# Altium schematic sheet modul RF.SchDoc
size A
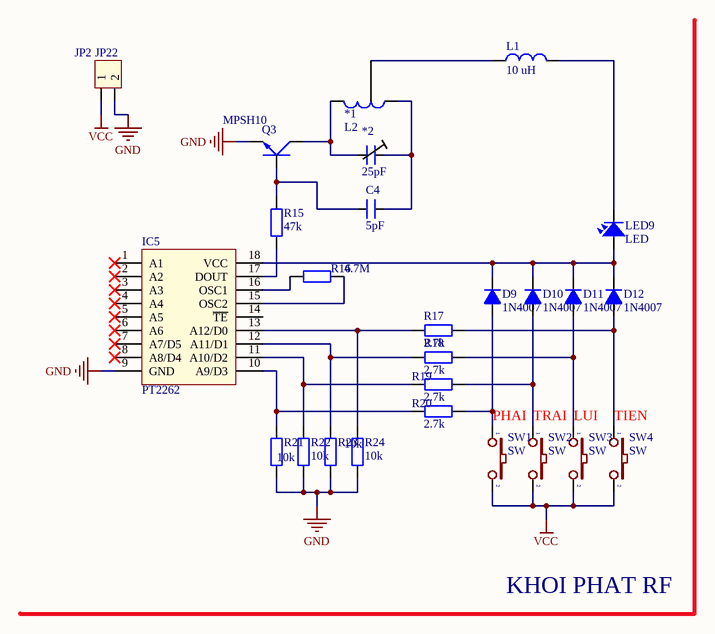
[diagram p0: modul RF.SchDoc]

## Parts
*1  L2
*2  25pF
C4  5pF  [CN1]
D9  1N4007  [D1A]
D10  1N4007  [D1A]
D11  1N4007  [D1A]
D12  1N4007  [D1A]
IC5  PT2262  [DIP18/W0.3]
JP22  JP2  [CON2]
L1  10 uH  [L/0.4]
LED9  LED  [LED-3]
Q3  MPSH10  [QTO-92]
R15  47k  [R1/4W]
R16  4.7M  [R1/4W]
R17  2.7k  [R1/4W]
R18  2.7k  [R1/4W]
R19  2.7k  [R1/4W]
R20  2.7k  [R1/4W]
R21  10k  [R1/4W]
R22  10k  [R1/4W]
R23  10k  [R1/4W]
R24  10k  [R1/4W]
SW1  SW  [SW2]
SW2  SW  [SW2]
SW3  SW  [SW2]
SW4  SW  [SW2]

## Nets
GND: IC5.9(GND) JP22.2 Q3.1(E) R21.1 R22.1 R23.1 R24.1
VCC: JP22.1 SW1.2 SW2.2 SW3.2 SW4.2
Net*1_1: *1.1 *2.2 C4.2
Net*1_2: *1.2 *2.1 Q3.2(C)
Net*1_?1: *1.?1 L1.1
NetC4_1: C4.1 Q3.3(B) R15.1
NetD9_1: D9.1(A) R20.1 SW1.1
NetD9_2: D9.2(K) D10.2(K) D11.2(K) D12.2(K) IC5.18(VCC) LED9.1
NetD10_1: D10.1(A) R19.1 SW2.1
NetD11_1: D11.1(A) R18.1 SW3.1
NetD12_1: D12.1(A) R17.1 SW4.1
NetIC5_10: IC5.10(A9/D3) R20.2 R21.2
NetIC5_11: IC5.11(A10/D2) R19.2 R22.2
NetIC5_12: IC5.12(A11/D1) R18.2 R23.2
NetIC5_13: IC5.13(A12/D0) R17.2 R24.2
NetIC5_15: IC5.15(OSC2) R16.2
NetIC5_16: IC5.16(OSC1) R16.1
NetIC5_17: IC5.17(DOUT) R15.2
NetL1_2: L1.2 LED9.2

Not connected (* = marked no-connect by the designer): IC5 1(A1)* 2(A2)* 3(A3)* 4(A4)* 5(A5)* 6(A6)* 7(A7/D5)* 8(A8/D4)* 14(~{TE})

## Notes on the sheet
- PHAI
- TRAI
- LUI
- (near SW4) TIEN
- KHOI PHAT RF

## Library data of the parts
*2 = tuxoay
C4 = CN1: Cap np  1pF - 472pF; Value: 100pF; Description: Cap np Cremic Value  1pF => 472 pF
D9-D12 = D1A: Diode 1A; Value: 1N4007
IC5 = PT2262: Remote Control Encoder
JP22 = Con2: Connector 2; Value: Connector 2
L1 = L1: Inductor; Value: 150 mH
LED9 = LED: LED Single colour Green and Red; Value: LED 3 ly Single Colour; Description: LED 5 ly Single Colour; Description: Led  Vuong
Q3 = C1815: NPN 600mW, ECB; Value: C1815
R15-R24 = R1/4W: Resistor 1/4W; Value: R1/4W - 1K
SW1-SW4 = SW2: Switch button 2 pin; Value: SW chip 2 pin